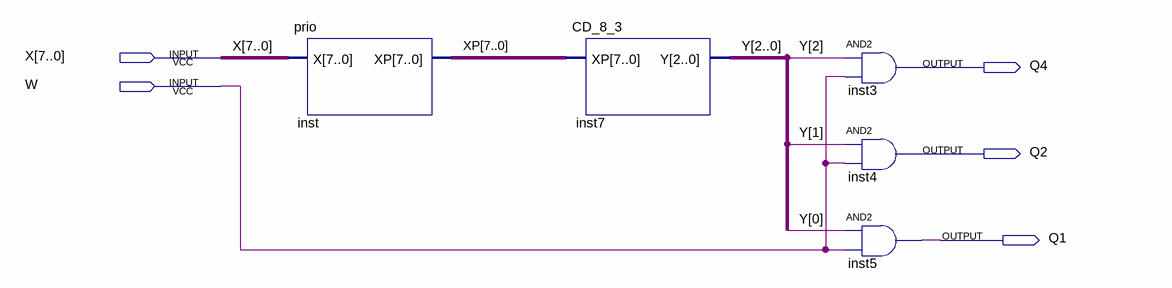
[diagram p0: schematic sheet]
// Quartus schematic CD_8_3_PRIO.bdf as structural Verilog: 5 symbols, 5 pins
module CD_8_3_PRIO (
  input  [7:0] X,
  input  W,
  output Q4,
  output Q2,
  output Q1
);

  wire [2:0] Y;
  wire [7:0] XP;

  prio inst (.X(X), .XP(XP));
  CD_8_3 inst7 (.XP(XP), .Y(Y));
  and inst3 (Q4, Y[2], W);
  and inst4 (Q2, Y[1], W);
  and inst5 (Q1, Y[0], W);
endmodule
